# Altium schematic sheet EvaluationCircuit.SCHDOC: LiveDesign Evaluation - Video Windows
size A4; Organization: Altium Limited; Address1: L3, 12a Rodborough Rd; Address2: Frenchs Forest; Address3: NSW; Address4: Australia 2086; DocumentNumber: 4; SheetNumber: 4; SheetTotal: 20
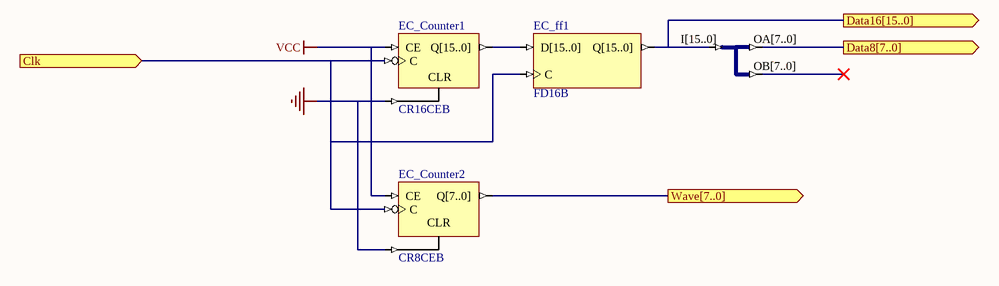
[diagram p0: EvaluationCircuit.SCHDOC]

## Parts
EC_Counter1  CR16CEB
EC_Counter2  CR8CEB
EC_ff1  FD16B
U1  J16B_8B2  (value not drawn)

## Ports
Clk (in), Data8[7..0] (out), Data16[15..0] (out), Wave[7..0] (out)

## Nets
GND: EC_Counter1.CLR EC_Counter2.CLR
VCC: EC_Counter1.CE EC_Counter2.CE
Clk: EC_Counter1.C EC_Counter2.C EC_ff1.C ; port Clk
Data8[7..0]: U1.OA[7..0] ; port Data8[7..0]
Data16[15..0]: EC_ff1.Q[15..0] U1.I[15..0] ; port Data16[15..0]
Wave[7..0]: EC_Counter2.Q[7..0] ; port Wave[7..0]
NetEC_Counter1_Q[15..0]: EC_Counter1.Q[15..0] EC_ff1.D[15..0]

Not connected (* = marked no-connect by the designer): U1 OB[7..0]*

## Notes on the sheet
- Title
- Size:
- Date:
- A4
- Number:
- Time:
- Revision:
- Sheet
- of
- File:

## Library data of the parts
EC_Counter1 = CR16CEB: 16-Bit Negative-Edge Binary Ripple Counters with Clock Enable and Asynchronous Clear, Bus Version; Xilinx Equivalent: CR16CE; ArchiveName: GENERIC; Published: 9-30-2003; Publisher: Altium Limited; Core Revision: 1.00.00
EC_Counter2 = CR8CEB: 8-Bit Negative-Edge Binary Ripple Counters with Clock Enable and Asynchronous Clear, Bus Version; Xilinx Equivalent: CR8CE; ArchiveName: GENERIC; Published: 9-30-2003; Publisher: Altium Limited; Core Revision: 1.00.00
EC_ff1 = FD16B: 16-Bit D-Type Flip-Flop, Bus Version; ArchiveName: GENERIC; Published: 9-30-2003; Publisher: Altium Limited; Core Revision: 1.00.00
U1 = J16B_8B2: 1 x 16-bit input bus to 2 x 8-Bit output bus; ArchiveName: GENERIC; VHDLIB_SIM: GENERIC_LIB; Published: 29-Jan-2004; Publisher: Altium Limited; Core Revision: 1.00.00